# EAGLE design Wellation_A0 (EAGLE 7.6.0)
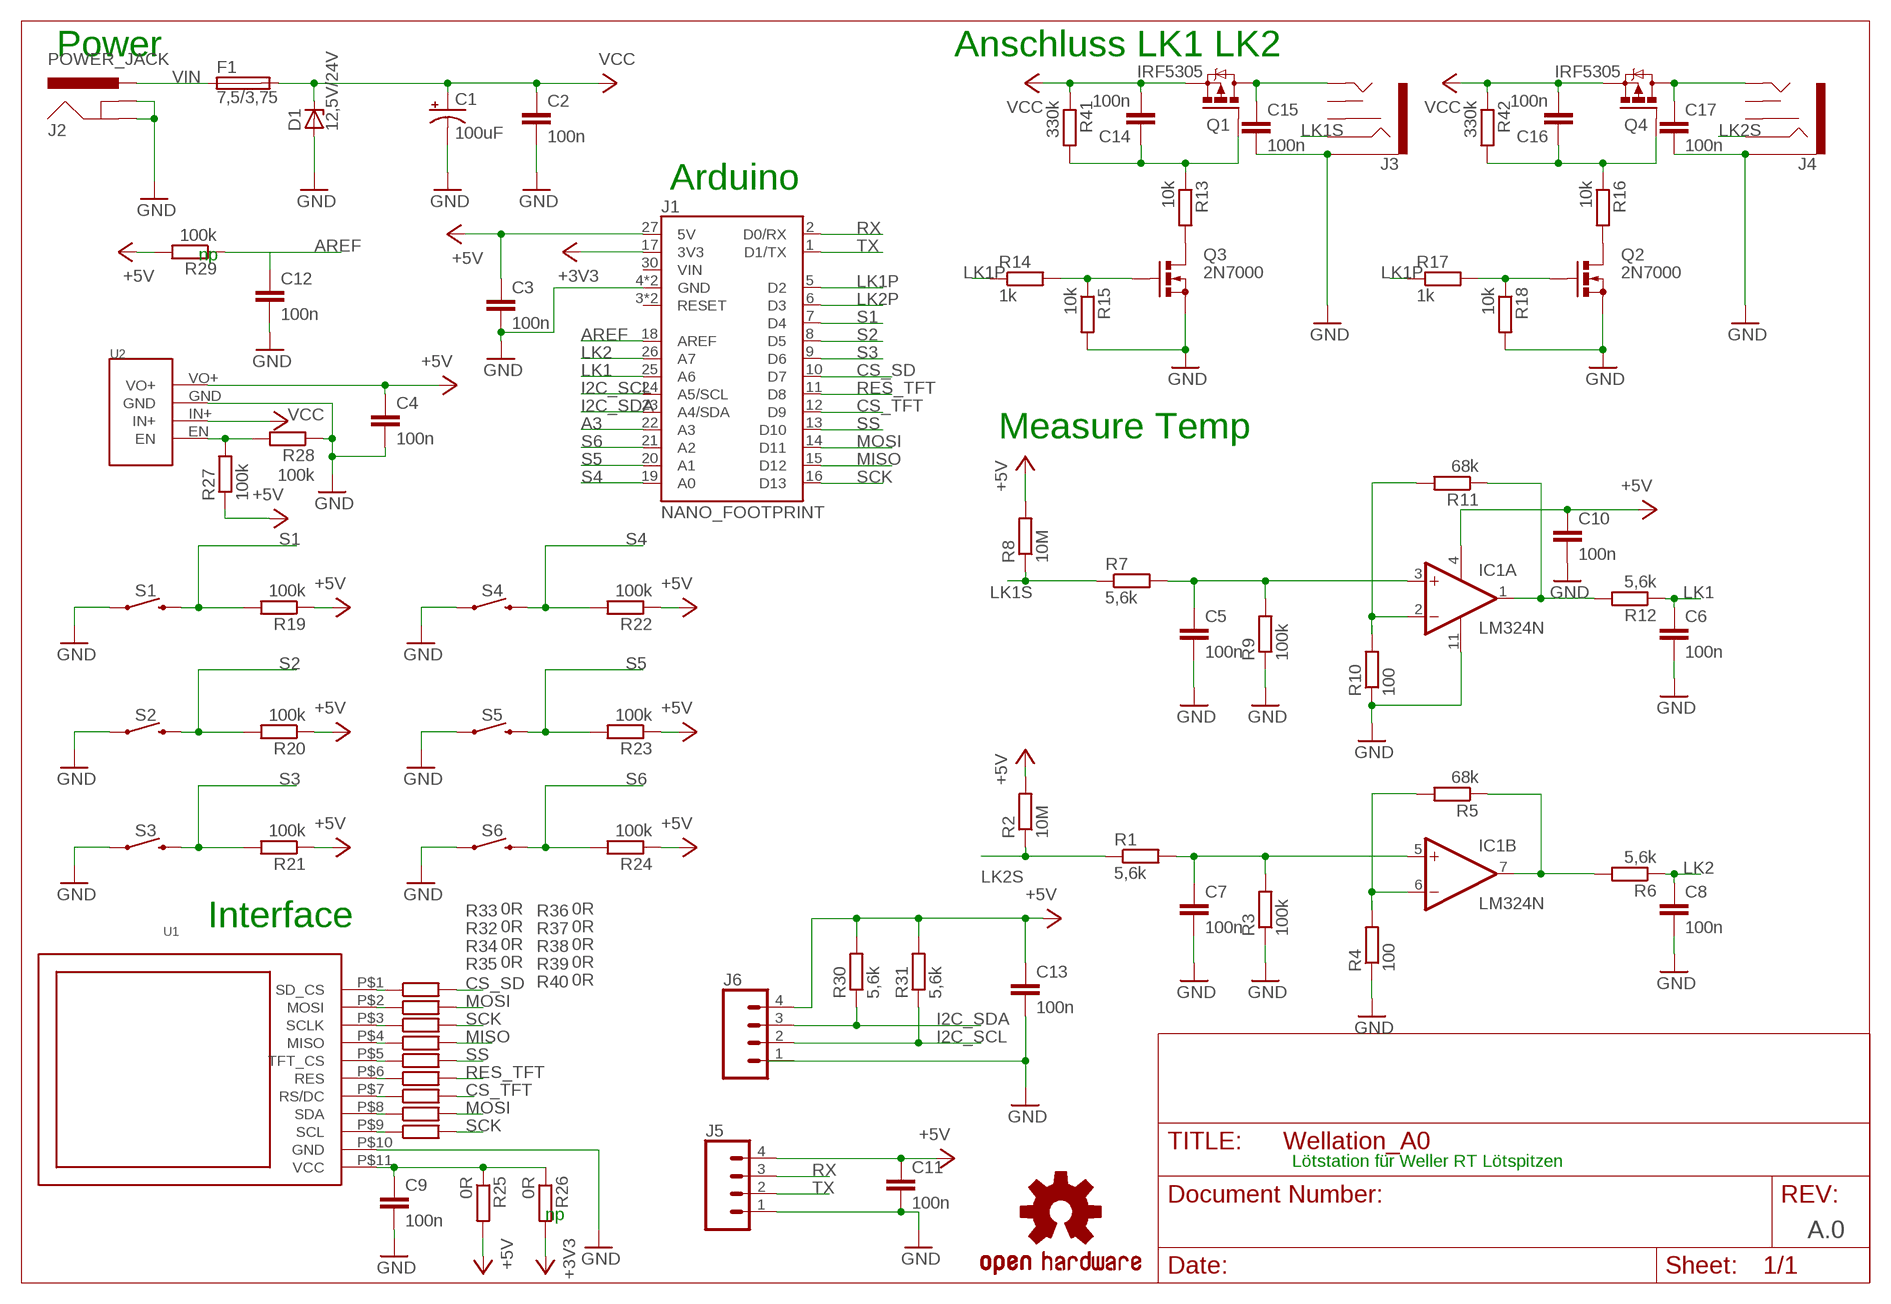
[diagram p0: schematic, sheet 1]

## Parts
C1  100uF  100UF-POLAR-RADIAL-2.5MM-25V-20%  [CPOL-RADIAL-2.5MM-6.5MM]
C2  100n  C-EUC0603K  [C0603K]
C3  100n  C-EUC0603K  [C0603K]
C4  100n  C-EUC0603K  [C0603K]
C5  100n  C-EUC0603K  [C0603K]
C6  100n  C-EUC0603K  [C0603K]
C7  100n  C-EUC0603K  [C0603K]
C8  100n  C-EUC0603K  [C0603K]
C9  100n  C-EUC0603K  [C0603K]
C10  100n  C-EUC0603K  [C0603K]
C11  100n  C-EUC0603K  [C0603K]
C12  100n  C-EUC0603K  [C0603K]
C13  100n  C-EUC0603K  [C0603K]
C14  100n  C-EUC0603K  [C0603K]
C15  100n  C-EUC0603K  [C0603K]
C16  100n  C-EUC0603K  [C0603K]
C17  100n  C-EUC0603K  [C0603K]
D1  12,5V/24V  ZENER-DIODEZD-12.5  [ZDIO12.5]
F1  7,5/3,75  GSH15  [GSH15]
IC1  LM324N  [DIL14]
J1  NANO_FOOTPRINT  [NANO]
J2  POWER_JACK  [POWER_JACK_PTH]
J3  AUDIO_JACK_3.5MM_PTH  [AUDIO-JACK]
J4  AUDIO_JACK_3.5MM_PTH  [AUDIO-JACK]
J5  CONN_04JST-PTH-VERT  [JST-4-PTH-VERT]
J6  CONN_04JST-PTH-VERT  [JST-4-PTH-VERT]
LOGO1  OSHW-LOGOM-COPPER  [OSHW-LOGO-M_COPPER]
Q1  IRF5305  IRF9530  [TO220BV]
Q2  2N7000  BS170  [SOT54E]
Q3  2N7000  BS170  [SOT54E]
Q4  IRF5305  IRF9530  [TO220BV]
R1  5,6k  R-EU_R0603  [R0603]
R2  10M  R-EU_R0603  [R0603]
R3  100k  R-EU_R0603  [R0603]
R4  100  R-EU_R0603  [R0603]
R5  68k  R-EU_R0603  [R0603]
R6  5,6k  R-EU_R0603  [R0603]
R7  5,6k  R-EU_R0603  [R0603]
R8  10M  R-EU_R0603  [R0603]
R9  100k  R-EU_R0603  [R0603]
R10  100  R-EU_R0603  [R0603]
R11  68k  R-EU_R0603  [R0603]
R12  5,6k  R-EU_R0603  [R0603]
R13  10k  R-EU_R0603  [R0603]
R14  1k  R-EU_R0603  [R0603]
R15  10k  R-EU_R0603  [R0603]
R16  10k  R-EU_R0603  [R0603]
R17  1k  R-EU_R0603  [R0603]
R18  10k  R-EU_R0603  [R0603]
R19  100k  R-EU_R0603  [R0603]
R20  100k  R-EU_R0603  [R0603]
R21  100k  R-EU_R0603  [R0603]
R22  100k  R-EU_R0603  [R0603]
R23  100k  R-EU_R0603  [R0603]
R24  100k  R-EU_R0603  [R0603]
R25  0R  R-EU_R0603  [R0603]
R26  0R  R-EU_R0603  [R0603]
R27  100k  R-EU_R0603  [R0603]
R28  100k  R-EU_R0603  [R0603]
R29  100k  R-EU_R0603  [R0603]
R30  5,6k  R-EU_R0603  [R0603]
R31  5,6k  R-EU_R0603  [R0603]
R32  0R  R-EU_R0603  [R0603]
R33  0R  R-EU_R0603  [R0603]
R34  0R  R-EU_R0603  [R0603]
R35  0R  R-EU_R0603  [R0603]
R36  0R  R-EU_R0603  [R0603]
R37  0R  R-EU_R0603  [R0603]
R38  0R  R-EU_R0603  [R0603]
R39  0R  R-EU_R0603  [R0603]
R40  0R  R-EU_R0603  [R0603]
R41  330k  R-EU_R0603  [R0603]
R42  330k  R-EU_R0603  [R0603]
S1  MOMENTARY-SWITCH-SPST-PTH-6.0MM  [TACTILE_SWITCH_PTH_6.0MM]
S2  MOMENTARY-SWITCH-SPST-PTH-6.0MM  [TACTILE_SWITCH_PTH_6.0MM]
S3  MOMENTARY-SWITCH-SPST-PTH-6.0MM  [TACTILE_SWITCH_PTH_6.0MM]
S4  MOMENTARY-SWITCH-SPST-PTH-6.0MM  [TACTILE_SWITCH_PTH_6.0MM]
S5  MOMENTARY-SWITCH-SPST-PTH-6.0MM  [TACTILE_SWITCH_PTH_6.0MM]
S6  MOMENTARY-SWITCH-SPST-PTH-6.0MM  [TACTILE_SWITCH_PTH_6.0MM]
U1  TFT1800WITHSD  [TFT1800WITHSD]
U2  MP2315  [MP2315_MODUL]

## Nets
+3V3: J1.17(3V3) R26.2
+5V: C3.1 C4.1 C10.1 C11.1 C13.1 IC1.4(P:V+) J1.27(5V) J5.4 J6.4 R2.2 R8.2 R19.1 R20.1 R21.1 R22.1 R23.1 R24.1 R25.2 R27.1 R29.2 R30.2 R31.2 U2.VO+
A3: J1.22(A3)
AREF: C12.1 J1.18(AREF) R29.1
CS_SD: J1.10(D7) R33.2
CS_TFT: J1.12(D9) R38.2
EN: R27.2 R28.2 U2.EN
GND: C1.2(-) C2.2 C3.2 C4.2 C5.2 C6.2 C7.2 C8.2 C9.2 C10.2 C11.2 C12.2 C13.2 C15.2 C17.2 D1.A IC1.11(P:V-) J1.4(GND) J1.29(GND) J2.GND J2.GNDBREAK J3.SLEEVE J4.SLEEVE J5.1 J6.1 Q2.S Q3.S R3.1 R4.1 R9.1 R10.1 R15.2 R18.2 R28.1 S1.1 S2.1 S3.1 S4.1 S5.1 S6.1 U1.P$10(GND) U2.GND
I2C_SCL: J1.24(A5/SCL) J6.2 R31.1
I2C_SDA: J1.23(A4/SDA) J6.3 R30.1
LK1: C6.1 J1.25(A6) R12.1
LK1P: J1.5(D2) R14.1 R17.1
LK1PP: C15.1 J3.TIP Q1.D
LK1PP1: C17.1 J4.TIP Q4.D
LK1S: J3.RING R7.1 R8.1
LK1SS: C5.1 IC1.3(A:+IN) R7.2 R9.2
LK2: C8.1 J1.26(A7) R6.1
LK2P: J1.6(D3)
LK2S: J4.RING R1.1 R2.1
LK2SS: C7.1 IC1.5(B:+IN) R1.2 R3.2
MF1: C14.1 Q1.G R13.1 R41.2
MF2: Q3.G R14.2 R15.1
MF3: C16.1 Q4.G R16.1 R42.2
MF4: Q2.G R17.2 R18.1
MISO: J1.15(D12) R35.2
MOSI: J1.14(D11) R32.2 R39.2
MP1S: Q3.D R13.2
MP2S: Q2.D R16.2
N$1: IC1.6(B:-IN) R4.2 R5.2
N$3: IC1.2(A:-IN) R10.2 R11.2
N$6: C9.1 R25.1 R26.1 U1.P$11(VCC)
OP1: IC1.1(A:OUT) R11.1 R12.2
OP2: IC1.7(B:OUT) R5.1 R6.2
RES_TFT: J1.11(D8) R37.2
RX: J1.2(D0/RX) J5.3
S1: J1.7(D4) R19.2 S1.3
S2: J1.8(D5) R20.2 S2.3
S3: J1.9(D6) R21.2 S3.3
S4: J1.19(A0) R22.2 S4.3
S5: J1.20(A1) R23.2 S5.3
S6: J1.21(A2) R24.2 S6.3
SCK: J1.16(D13) R34.2 R40.2
SD_CS: R33.1 U1.P$1(SD_CS)
SD_MISO: R35.1 U1.P$4(MISO)
SD_MOSI: R32.1 U1.P$2(MOSI)
SD_SCK: R34.1 U1.P$3(SCLK)
SS: J1.13(D10) R36.2
TFT_CS: R38.1 U1.P$7(RS/DC)
TFT_MOSI: R39.1 U1.P$8(SDA)
TFT_RES: R37.1 U1.P$6(RES)
TFT_SCK: R40.1 U1.P$9(SCL)
TFT_SS: R36.1 U1.P$5(TFT_CS)
TX: J1.1(D1/TX) J5.2
VCC: C1.1(+) C2.1 C14.2 C16.2 D1.C F1.2 Q1.S Q4.S R41.1 R42.1 U2.IN+
VIN: F1.1 J2.PWR
Unconnected: IC1.8(C:OUT) IC1.9(C:-IN) IC1.10(C:+IN) IC1.12(D:+IN) IC1.13(D:-IN) IC1.14(D:OUT) J1.3(RESET) J1.28(RESET) J1.30(VIN) J3.RSH J3.TSH J4.RSH J4.TSH

## Notes on the sheet
- Power | Anschluss LK1 LK2
- Arduino
- np
- Measure Temp
- Interface
- Lötstation für Weller RT Lötspitzen
- np
- A.0

## Library data of the parts
C1 = SparkFun-Capacitors:100UF-POLAR: 100µF polarized capacitors A capacitor is a passive two-terminal electrical component used to store electrical energy temporarily in an electric field.; PROD_ID: CAP-08439
C2-C17 = rcl:C-EU: CAPACITOR, European symbol
D1 = diode:ZENER-DIODE: Z-Diode
F1 = fuse:GSH15: FUSE HOLDER grid 15mm, 19649 Wickmann; MPN: 64900001039; OC_FARNELL: 1271673; OC_NEWARK: 02P0318
IC1 = linear:LM324: OP AMP
J1 = SparkFun-Boards:NANO_FOOTPRINT: Generic Nano Footprint
J2 = SparkFun-Connectors:POWER_JACK: Power Jack Connector This is the standard 5.5mm barrel jack for power. The PTH is the most common, proven, reliable, footprint. The Slot footprint only works if the mill layer is transmitted to the PCB fab house so be warned. Here are the connectors we sell at SparkFun: DC Barrel Power Jack/Connector <https://www.sparkfun.com/products/119> (PRT-00119) DC Barrel Power Jack/Connector (SMD) <https://www.sparkfun.com/products/12748> (PRT-12748) DC Barrel Jack Adapter - Breadboard Compatible <https://www.sparkfun.com/products/10811> (PRT-10811) It is used on this SparkFun product (and many, many others): SparkFun RedBoard - Programmed with Arduino <https://www.sparkfun.com/products/12757> (DEV-12757) Also, if you need a mating power supply or connector, please check these out: Wall Adapter Power Supply - 9VDC 650mA <https://www.sparkfun.com/products/298> (TOL-00298) DC Barrel Jack Adapter - Male <https://www.sparkfun.com/products/10287> (PRT-10287); PROD_ID: CONN-08197
J3 J4 = SparkFun-Connectors:AUDIO_JACK_3.5MM: Audio Jack 3.5mm variants of PTH and SMT stereo audio jack with bypass switches. SparkFun Products: SparkFun SparkPunk Sound Kit <[https://www.sparkfun.com/products/11177]> - PTH MP3 Trigger <https://www.sparkfun.com/products/13720> -3.5mm SMD SparkFun PicoBoard <https://www.sparkfun.com/products/11888>- 2.5mm SMD; PROD_ID: CONN-08774; SF_ID: PRT-08032
J5 J6 = SparkFun-Connectors:CONN_04: Multi connection point. Often used as Generic Header-pin footprint for 0.1 inch spaced/style header connections On any of the 0.1 inch spaced packages, you can populate with these: Break Away Headers - Straight <https://www.sparkfun.com/products/116> (PRT-00116) Break Away Male Headers - Right Angle <https://www.sparkfun.com/products/553> (PRT-00553) Female Headers <https://www.sparkfun.com/products/115> (PRT-00115) Break Away Headers - Machine Pin <https://www.sparkfun.com/products/117> (PRT-00117) Break Away Female Headers - Swiss Machine Pin <https://www.sparkfun.com/products/743> (PRT-00743) For SCREWTERMINALS and SPRING TERMINALS visit here: Screw Terimnals on SparkFun.com <https://www.sparkfun.com/search/results?term=Screw+Terminals> (5mm/3.5mm/2.54mm spacing) This device is also useful as a general connection point to wire up your design to another part of your project. Our various solder wires solder well into these plated through hole pads. Hook-Up Wire - Assortment (Stranded, 22 AWG) <https://www.sparkfun.com/products/11375> (PRT-11375) Hook-Up Wire - Assortment (Solid Core, 22 AWG) <https://www.sparkfun.com/products/11367> (PRT-11367) View the entire wire category on our website here <https://www.sparkfun.com/categories/141> Special notes: Molex polarized connector foot print use with SKU : PRT-08231 with associated crimp pins and housings. 1MM SMD Version SKU: PRT-10208; PROD_ID: CONN-13251
LOGO1 = SparkFun-Aesthetics:OSHW-LOGO: Open-Source Hardware (OSHW) Logo This logo indicates the piece of hardware it is found on incorporates a OSHW license and/or adheres to the definition of open source hardware found here: http://freedomdefined.org/OSHW
Q1 Q4 = transistor-power:IRF9530: P-CHANNEL HEXFET POWER-MOS-FET Source: http://www.irf.com/product-info/datasheets/data/irf9530.pdf
Q2 Q3 = transistor-small-signal:BS170: N-CHANNEL MOS FET
R1-R42 = rcl:R-EU_: RESISTOR, European symbol
S1-S6 = SparkFun-Switches:MOMENTARY-SWITCH-SPST: Momentary Switch (Pushbutton) - SPST Normally-open (NO) SPST momentary switches (buttons, pushbuttons). Variants PTH-12MM - 12mm square, through-hole Momentary Pushbutton Switch - 12mm Square <https://www.sparkfun.com/products/9190> (COM-09190) PTH-6.0MM, PTH-6.0MM-KIT - 6.0mm square, through-hole Mini Pushbutton Switch <https://www.sparkfun.com/products/97> (COM-00097) KIT package intended for soldering kit's - only one side of pads' copper is exposed. PTH-RIGHT-ANGLE-KIT - Right-angle, through-hole Right Angle Tactile Button <https://www.sparkfun.com/products/10791> - Used on SparkFun BigTime Watch Kit <https://www.sparkfun.com/products/11734> SMD-12MM - 12mm square, surface-mount Tactile Button - SMD (12mm) <https://www.sparkfun.com/products/12993> (COM-12993) Used on SparkFun PicoBoard <https://www.sparkfun.com/products/11888> SMD-4.5MM - 4.5mm Square Trackball Switch Used on SparkFun Blackberry Trackballer Breakout <https://www.sparkfun.com/products/13169> SMD-4.6MMX2.8MM - 4.60mm x 2.80mm, surface mount Used on SparkFun SAMD21 Mini Breakout <https://www.sparkfun.com/products/13664> SMD-5.2MM, SMD-5.2-REDUNDANT - 5.2mm square, surface-mount Mini Pushbutton Switch - SMD <https://www.sparkfun.com/products/8720> (COM-08720) Used on Arduino Pro Mini <https://www.sparkfun.com/products/11114> REDUNDANT package connects both switch circuits together SMD-6.0X3.5MM - 6.0 x 3.5mm, surface mount Momentary Reset Switch SMD <https://www.sparkfun.com/products/8229> (COM-08229) SMD-6.2MM-TALL - 6.2mm square, surface mount Tactile Button - SMD (6mm) <https://www.sparkfun.com/products/12992> Used on SparkFun Digital Sandbox <https://www.sparkfun.com/products/12651> SMD-RIGHT-ANGLE - Right-angle, surface mount Used on SparkFun Block for Intel® Edison - Arduino <https://www.sparkfun.com/products/13036>; PROD_ID: SWCH-08441; SF_SKU: COM-00097
U1 = inode:TFT1800WITHSD: Adafruit TFT 1.8" with SD (ST7735) 1.8" 18-bit color TFT LCD display with microSD card breakout http://www.adafruit.com/products/358
U2 = specialparts:MP2315

## Board
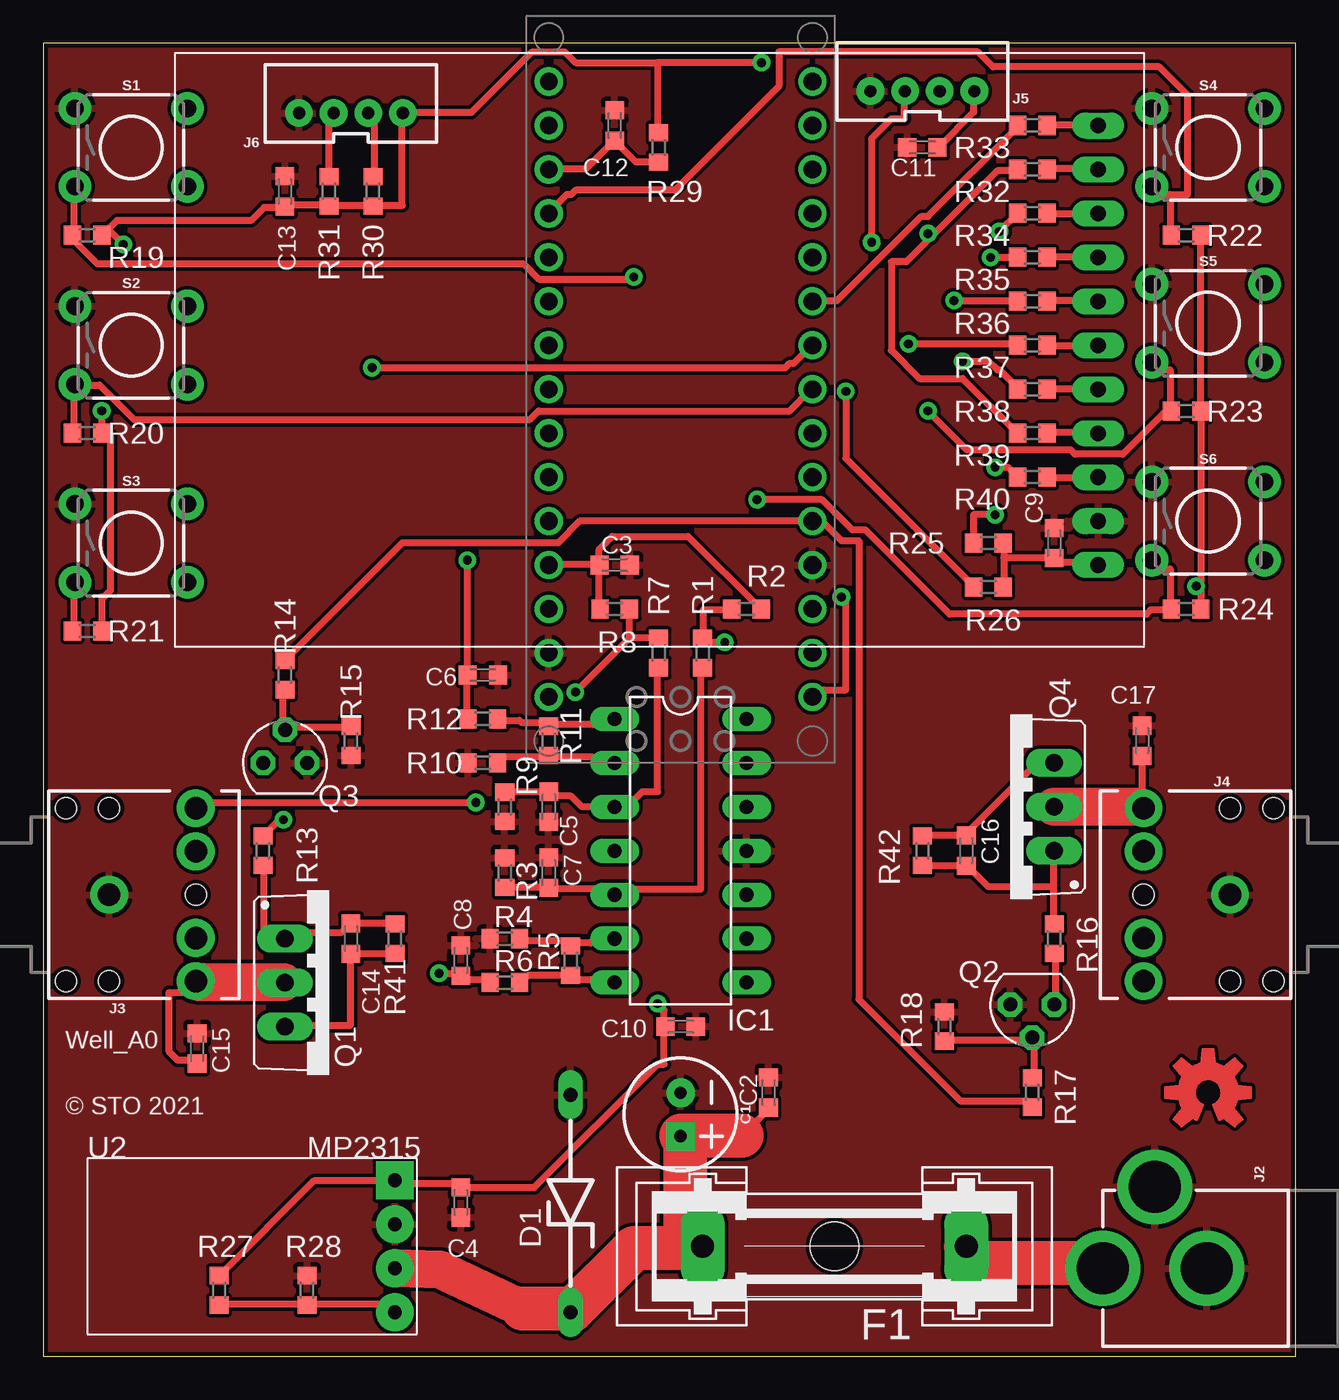
[diagram p1: board, top side]
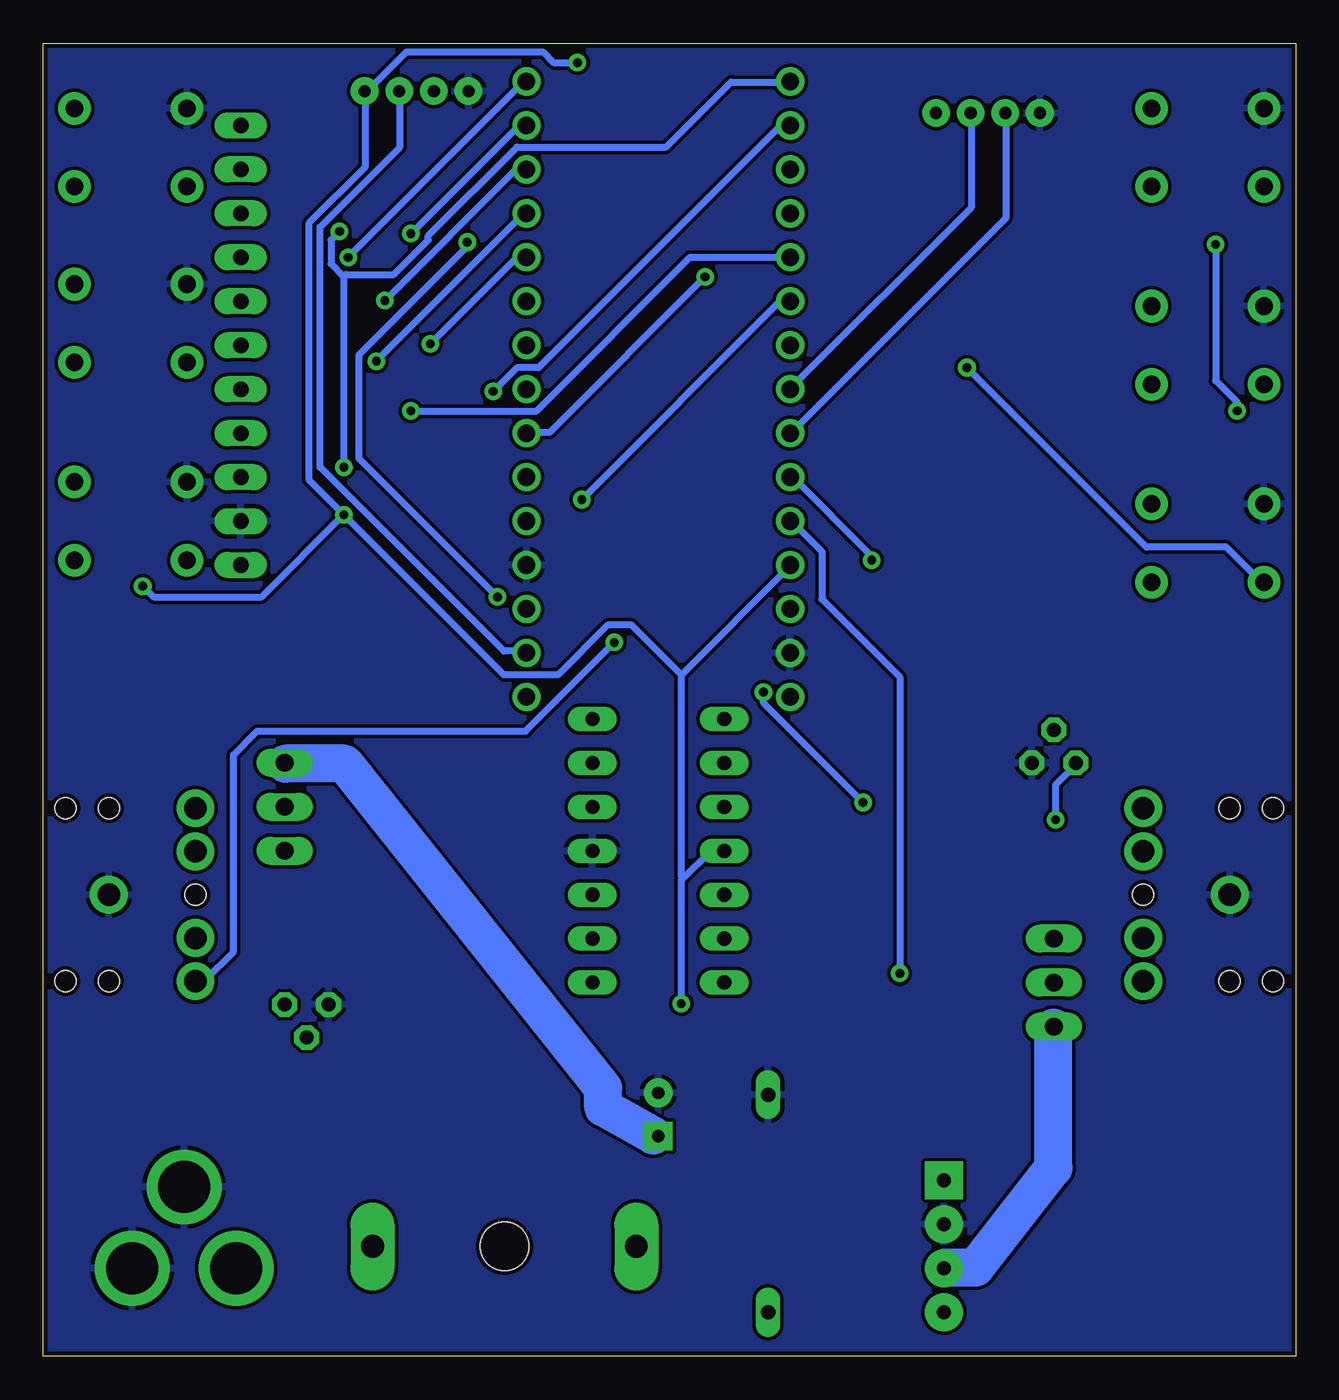
[diagram p2: board, bottom side, seen from below]

Size 72.37 x 75.87 mm. Coordinates in mm from the lower left corner, seen from the top.
Outline: 0,0 72.37,0 72.37,75.87 0,75.87 0,0
Copper layers (1*16): Top 0.035mm / dielectric 1.5mm / Bottom 0.035mm
Design rules "SparkFun *": minimum track width 16mil, minimum drill 20mil, track to track 8mil, track to pad 8mil, pad to pad 8mil, via to via 8mil, smd to smd 8mil, copper to edge 10mil, drill to drill 8mil, minimum pad ring 12mil, minimum via ring 10mil, stop-mask expansion 4mil, vias tented up to drill 25mil, thermal gap 10mil

### Footprints (pad centres in the part's own frame; a part is rotated, then mirrored left to right if it is on the bottom)
CPOL-RADIAL-2.5MM-6.5MM = drill 0.7 pad 1.651 square: 1 1.25,0 | drill 0.7 pad 1.651: 2 -1.25,0
C0603K = smd 1.05 x 1.08: 1 -0.875,0; 2 0.875,0
ZDIO12.5 = drill 0.813 long: A 6.223,0; C -6.35,0
GSH15 = drill 1.321 pad 2.54 long: 1 -7.62,0; 2 7.62,0 | hole 2.794: 0,0
DIL14 = drill 0.813 long: 1 -7.62,-3.81; 2 -5.08,-3.81; 3 -2.54,-3.81; 4 0,-3.81; 5 2.54,-3.81; 6 5.08,-3.81; 7 7.62,-3.81; 8 7.62,3.81; 9 5.08,3.81; 10 2.54,3.81; 11 0,3.81; 12 -2.54,3.81; 13 -5.08,3.81; 14 -7.62,3.81
NANO = drill 1.016: 1 -7.62,17.78; 2 -7.62,15.24; 3 -7.62,12.7; 4 -7.62,10.16; 5 -7.62,7.62; 6 -7.62,5.08; 7 -7.62,2.54; 8 -7.62,0; 9 -7.62,-2.54; 10 -7.62,-5.08; 11 -7.62,-7.62; 12 -7.62,-10.16; 13 -7.62,-12.7; 14 -7.62,-15.24; 15 -7.62,-17.78; 16 7.62,-17.78; 17 7.62,-15.24; 18 7.62,-12.7; 19 7.62,-10.16; 20 7.62,-7.62; 21 7.62,-5.08; 22 7.62,-2.54; 23 7.62,0; 24 7.62,2.54; 25 7.62,5.08; 26 7.62,7.62; 27 7.62,10.16; 28 7.62,12.7; 29 7.62,15.24; 30 7.62,17.78
POWER_JACK_PTH = drill 2.997 pad 4.318: GND 0,7.7; GNDBREAK 4.7,10.7; PWR 0,13.7
AUDIO-JACK = drill 1.3 pad 2.184: RING 5,5; RSH 5,2.5; SLEEVE 0,0; TIP 5,-5; TSH 5,-2.5 | hole 1.2: 0,5; -2.5,5; -2.5,-5; 0,-5; 5,0
JST-4-PTH-VERT = drill 0.7 pad 1.6: 1 -3,-0.55; 2 -1,-0.55; 3 1,-0.55; 4 3,-0.55
TO220BV = drill 1.016 long: D 0,-2.54; G -2.54,-2.54; S 2.54,-2.54
SOT54E = drill 0.813 octagon: D -1.27,0; G 0,1.905; S 1.27,0
R0603 = smd 1 x 1.1: 1 -0.85,0; 2 0.85,0
TACTILE_SWITCH_PTH_6.0MM = drill 1.016 pad 1.88: 1 -3.251,2.261; 2 3.251,2.261; 3 -3.251,-2.261; 4 3.251,-2.261
TFT1800WITHSD = drill 0.9 long: P$1 24.13,12.7; P$2 24.13,10.16; P$3 24.13,7.62; P$4 24.13,5.08; P$5 24.13,2.54; P$6 24.13,0; P$7 24.13,-2.54; P$8 24.13,-5.08; P$9 24.13,-7.62; P$10 24.13,-10.16; P$11 24.13,-12.7
MP2315_MODUL = drill 0.8 pad 2.184: EN 17.78,1.27; GND 17.78,6.35; IN+ 17.78,3.81 | drill 0.8 pad 2.184 square: VO+ 17.78,8.89

### Placement (x,y rotation side)
C1  36.83,13.97 270 top
C2  41.91,15.24 90 top
C3  33.02,45.72 0 top
C4  24.13,8.89 270 top
C5  29.21,31.75 270 top
C6  25.4,39.37 0 top
C7  29.21,27.94 90 top
C8  24.13,22.86 90 top
C9  58.42,46.99 90 top
C10  36.83,19.05 0 top
C11  50.8,69.85 180 top
C12  33.02,71.12 90 top
C13  13.97,67.31 90 top
C14  17.78,24.13 270 top
C15  8.89,17.78 90 top
C16  53.34,29.21 90 top
C17  63.5,35.56 90 top
D1  30.48,8.89 90 top
F1  45.72,6.35 180 top
IC1  36.83,29.21 270 top
J1  36.83,55.88 180 top
J2  74.93,5.08 90 top
J3  3.81,26.67 0 top
J4  68.58,26.67 180 top
J5  50.8,73.66 0 top
J6  17.78,72.39 0 top
LOGO1  67.31,15.24 0 top
Q1  16.51,21.59 270 top
Q2  57.15,20.32 180 top
Q3  13.97,34.29 0 top
Q4  55.88,31.75 90 top
R1  38.1,40.64 270 top
R2  40.64,43.18 0 top
R3  26.67,27.94 270 top
R4  26.67,24.13 0 top
R5  30.48,22.86 90 top
R6  26.67,21.59 0 top
R7  35.56,40.64 270 top
R8  33.02,43.18 180 top
R9  26.67,31.75 90 top
R10  25.4,34.29 0 top
R11  29.21,35.56 270 top
R12  25.4,36.83 0 top
R13  12.7,29.21 90 top
R14  13.97,39.37 270 top
R15  17.78,35.56 270 top
R16  58.42,24.13 270 top
R17  57.15,15.24 90 top
R18  52.07,19.05 90 top
R19  2.54,64.77 180 top
R20  2.54,53.34 180 top
R21  2.54,41.91 180 top
R22  66.04,64.77 180 top
R23  66.04,54.61 180 top
R24  66.04,43.18 180 top
R25  54.61,46.99 180 top
R26  54.61,44.45 180 top
R27  10.16,3.81 270 top
R28  15.24,3.81 270 top
R29  35.56,69.85 90 top
R30  19.05,67.31 270 top
R31  16.51,67.31 270 top
R32  57.15,68.58 180 top
R33  57.15,71.12 180 top
R34  57.15,66.04 180 top
R35  57.15,63.5 180 top
R36  57.15,60.96 180 top
R37  57.15,58.42 180 top
R38  57.15,55.88 180 top
R39  57.15,53.34 180 top
R40  57.15,50.8 180 top
R41  20.32,24.13 90 top
R42  50.8,29.21 270 top
S1  5.08,69.85 0 top
S2  5.08,58.42 0 top
S3  5.08,46.99 0 top
S4  67.31,69.85 0 top
S5  67.31,59.69 0 top
S6  67.31,48.26 0 top
U1  36.83,58.42 0 top
U2  2.54,1.27 0 top

### Tracks (layer width: path | path; a pad name or v marks a point on that pad's centre or on a via)
+3V3  (via drill 0.51)
  Top 0.406: v46.38,55.75 46.38,51.88 53.75,44.5 R26.2
  Bottom 0.406: v46.38,55.75 45,57.12 43.75,57.12 29.88,71 29.25,71 J1.17
+5V  (via drill 0.51)
  Top 0.406: 35.5,74.75 35.5,70.75 R29.2 | 35.5,74.75 30.75,74.75 30.12,75.38 28.25,75.38 24.75,71.88 20.88,71.88 J6.4 20.75,71.75 20.75,66.5 19.25,66.5 R30.2 19,66.5 16.62,66.5 R31.2 16.5,66.5 14,66.5 C13.1 13.88,66.38 12.75,66.38 12,65.62 4.25,65.62 3.5,64.88 R19.1 3.88,65 v4.62,64.25 | R21.1 3.38,42 3.38,43.88 3.5,43.88 3.88,44.25 3.88,53.25 3.5,53.25 R20.1 3.38,53.5 v3.38,54.62 | C11.1 51.75,69.88 53.75,71.88 53.75,73 J5.4 | 66.88,44.5 66.88,54.5 R23.1 66.88,54.75 66.88,64.75 R22.1 | 66.88,44.5 66.88,43.25 R24.1 | v55,48.62 53.75,48.62 R25.2 | v66.62,44.5 66.88,44.5 | C3.1 32.12,45.62 32.12,43.25 R8.2 | R2.2 41.38,43.25 37.25,47.38 32.88,47.38 32.12,46.62 32.12,45.88 C3.1 | J1.27 29.25,45.75 32,45.75 C3.1 | R27.1 15.62,10.12 20.12,10.12 U2.VO+ 20.38,10.12 20.5,10 24,10 24.12,9.88 C4.1 24.25,9.75 28.38,9.75 35.5,16.88 35.88,16.88 35.88,19 C10.1 35.88,19.12 35.88,20 v35.5,20.38 | v41.5,74.75 35.5,74.75
  Bottom 0.406: v3.38,54.62 3.38,55.12 4.62,56.38 v4.62,64.25 | v55,48.62 59.75,43.88 66,43.88 v66.62,44.5 | v55,48.62 57,50.62 57,65.5 53.75,68.75 53.75,73 J5.4 53.62,73.12 51.38,75.38 43.5,75.38 42.88,74.75 v41.5,74.75 | 35.38,27.62 35.5,27.5 v35.5,20.38 | 35.38,27.62 33.88,29.12 33.12,29.12 IC1.4 | 35.5,39.38 29.25,45.62 J1.27 | 35.5,39.38 35.5,27.75 35.38,27.62 | v55,48.62 45.75,39.38 42.62,39.38 39.75,42.25 38.38,42.25 35.5,39.38
AREF
  Top 0.406: R29.1 34.25,69 33.12,70.12 C12.1 32.88,70.12 31.38,68.62 29.25,68.62 J1.18
CS_SD
  Top 0.406: R33.2 56.25,71 51.12,65.88 50.75,65.88 45.88,61 44.5,61 J1.10
CS_TFT  (via drill 0.51)
  Top 0.406: v53.12,57.5 54.62,57.5 55.12,57 55.25,57 56.25,56 R38.2
  Bottom 0.406: v53.12,57.5 44.5,66.12 J1.12
EN
  Top 0.406: R27.2 10.25,3 15.12,3 R28.2 15.38,3 19.38,3 19.75,2.62 20.25,2.62 U2.EN
GND
  pour Top: 0,0 72.39,0 72.39,76.2 0,76.2
  pour Bottom: 0,0 72.39,0 72.39,76.2 0,76.2
I2C_SCL
  Top 0.406: R31.1 16.5,68.25 16.5,71.75 16.75,71.75 J6.2
  Bottom 0.406: J1.24 29.12,53.38 16.75,65.75 16.75,71.75 J6.2
I2C_SDA
  Top 0.406: R30.1 19.12,68.25 19.12,71.75 18.88,71.75 J6.3
  Bottom 0.406: J1.23 29.12,56 18.75,66.38 18.75,71.75 J6.3
LK1  (via drill 0.51)
  Top 0.406: R12.1 24.5,36.88 24.5,39.25 C6.1 24.5,39.5 v24.5,46
  Bottom 0.406: v24.5,46 24.5,46.25 29.12,50.88 J1.25
LK1P
  Top 0.406: R14.1 20.75,47 29.75,47 31,48.25 44.38,48.25 J1.5 44.62,48.25 45,48.25 46.12,47.12 47.12,47.12 47.12,20.62 53,14.75 56.88,14.75 57.12,14.5 R17.1
LK1PP
  Top 0.406: C15.1 8.88,17 8.75,17.12 7.75,17.12 7.25,17.62 7.25,21 8,21 8.62,21.62 8.75,21.62 J3.TIP 9,21.62 | 13.88,21.62 Q1.D
  Top 2.184: 9,21.62 13.88,21.62
LK1PP1
  Top 0.406: C17.1 63.5,31.75 J4.TIP 63.38,31.75
  Top 2.184: 63.38,31.75 Q4.D
LK1S  (via drill 0.51)
  Top 0.406: 33.88,41.5 33.88,43.12 R8.1 | 33.88,41.5 35.5,41.5 R7.1 | v30.75,38.38 33.88,41.5 | v25,32 9.12,32 8.88,31.75 J3.RING
  Bottom 0.406: v30.75,38.38 30.75,37.75 v25,32
LK1SS
  Top 0.406: R9.2 26.75,32.62 C5.1 29.38,32.62 29.62,32.38 30.5,32.38 31.12,31.75 IC1.3 33.75,31.75 34.62,32.62 35.5,32.62 35.5,39.75 R7.2
LK2  (via drill 0.51)
  Top 0.406: R6.1 25.75,21.62 25.62,21.75 24.38,21.75 24.25,21.88 C8.1 24,22.12 v22.88,22.12
  Bottom 0.406: v22.88,22.12 22.88,39.25 27.38,43.75 27.38,46.5 29.12,48.25 J1.26
LK2S  (via drill 0.51)
  Top 0.406: R2.1 39.75,43.12 38.12,43.12 38.12,41.5 R1.1 38.25,41.38 38.38,41.25 v39.38,41.25
  Bottom 0.406: v39.38,41.25 44.5,36.12 60,36.12 61.38,34.75 61.38,23.38 63,21.75 63.5,21.75 J4.RING
LK2SS
  Top 0.406: R3.2 26.75,27.12 29.12,27.12 C7.1 29.38,27 34,27 IC1.5 33.12,26.75 34,26.75 34.25,27 38,27 38,39.75 R1.2
MF1
  Top 0.406: R41.2 20.25,25 17.88,25 C14.1 17.62,24.88 17.25,24.5 12.88,24.5 Q1.G 13.88,24.25 12.75,24.25 12.75,28.25 R13.1
MF2
  Top 0.406: R14.2 13.88,38.5 13.88,36.25 Q3.G 14,36.38 17.75,36.38 R15.1
MF3
  Top 0.406: R42.2 50.88,28.38 53.25,28.38 C16.1 53.5,28.25 54.62,27.12 58.38,27.12 | 58.38,27.12 58.38,29.12 Q4.G | 58.38,27.12 58.38,25 R16.1
MF4
  Top 0.406: R18.1 52.12,18.25 57,18.25 57.12,18.38 Q2.G 57.12,18.12 57.25,18.12 57.25,16.12 R17.2
MISO  (via drill 0.51)
  Top 0.406: v54.75,63.5 R35.2
  Bottom 0.406: v54.75,63.5 44.5,73.75 J1.15
MOSI  (via drill 0.51)
  Top 0.406: 51.38,64.75 55.12,68.5 56.25,68.5 R32.2 | 51.38,64.75 49.88,63.25 49,63.25 49,58.12 50.62,56.5 53.12,56.5 56.25,53.38 R39.2 | v51.12,64.88 51.25,64.88 51.38,64.75
  Bottom 0.406: v51.12,64.88 45,71 44.5,71 J1.14
MP1S  (via drill 0.51)
  Top 0.406: v13.88,31 13.62,31 12.75,30.12 R13.2
  Bottom 0.406: v13.88,31 13.88,33 12.62,34.25 Q3.D
MP2S
  Top 0.406: R16.2 58.5,23.25 58.5,20.38 Q2.D
N$1
  Top 0.406: IC1.6 33,24.12 31.88,24.12 31.62,23.88 30.62,23.88 30.5,23.75 R5.2 30.5,24 27.75,24 27.62,24.12 R4.2
N$3
  Top 0.406: R10.2 26.25,34.38 26.5,34.62 29.12,34.62 R11.2 29.38,34.62 31.75,34.62 32,34.38 33,34.38 IC1.2
N$6
  Top 0.406: 55.5,46.12 55.5,46.88 R25.1 | 55.5,46.12 55.5,44.5 R26.1 | U1.P$11 60.88,45.75 60.75,45.88 58.62,45.88 58.5,46 C9.1 58.25,46.12 55.5,46.12
OP1
  Top 0.406: R12.2 26.25,36.75 27.5,36.75 27.62,36.62 29,36.62 29.12,36.5 R11.1 29.38,36.5 31.75,36.5 32,36.75 33,36.75 IC1.1
OP2
  Top 0.406: R6.2 27.62,21.62 28,22 30.38,22 R5.1 30.62,21.88 30.75,21.75 32.88,21.75 33,21.62 IC1.7
RES_TFT  (via drill 0.51)
  Top 0.406: v50,58.5 56.25,58.5 R37.2
  Bottom 0.406: v50,58.5 45,63.5 J1.11
RX
  Bottom 0.406: J5.3 51.75,73 51.75,69.88 56.38,65.25 56.38,51.38 45.75,40.75 44.5,40.75 J1.2
S1  (via drill 0.51)
  Top 0.406: S1.3 1.75,67.5 1.75,64.88 R19.2 1.62,64.62 3.12,63.12 27.75,63.12 28.62,62.25 34,62.25 v34.12,62.38
  Bottom 0.406: v34.12,62.38 43.12,53.38 44.38,53.38 J1.7
S2
  Top 0.406: R20.2 1.75,53.38 1.75,56.12 S2.3 2,56.12 3.25,56.12 5.25,54.12 28.12,54.12 28.62,54.62 43.12,54.62 44.38,55.88 J1.8
S3  (via drill 0.51)
  Top 0.406: R21.2 1.75,42 1.75,44.62 S3.3 | v19,57.12 42.88,57.12 43.12,57.38 43.38,57.38 44.38,58.38 J1.9
  Bottom 0.406: v19,57.12 8.62,46.75 4,46.75 1.88,44.62 S3.3
S4
  Top 0.406: 65.12,67.12 65.12,64.88 R22.2 | 65.12,67.12 64.5,67.12 64.12,67.5 S4.3 | 65.12,67.12 66.12,67.12 66.12,72.88 64.5,74.5 54.88,74.5 54,75.38 42.5,75.38 42.5,73.38 36.5,67.38 30.75,67.38 30.5,67.12 30.25,67.12 29.25,66.12 J1.19
S5  (via drill 0.51)
  Top 0.406: S5.3 64.12,57.38 64.5,57 65.12,57 65.12,54.62 R23.2 65,54.5 64.75,54.5 62.38,52.12 59.62,52.12 59.38,52.38 53.38,52.38 v51.12,54.62
  Bottom 0.406: J1.20 35,63.5 43.88,54.62 v51.12,54.62
S6  (via drill 0.51)
  Top 0.406: S6.3 64.12,45.88 64.38,45.88 64.75,45.5 65.12,45.5 65.12,43.25 R24.2 65,43.12 64,43.12 63.75,42.88 52.38,42.88 47.5,47.75 46.75,47.75 45,49.5 v41.25,49.5
  Bottom 0.406: v41.25,49.5 29.88,60.88 29.25,60.88 J1.21
SCK  (via drill 0.51)
  Top 0.406: v55,51.38 55.75,51.38 56.25,50.88 R40.2 | v55.25,65 56.25,66 R34.2
  Bottom 0.406: 55,62.38 v55,51.38 | 55,62.38 55.75,63.12 55.75,64.5 v55.25,65 | J1.16 29.25,73.62 32.62,73.62 36.38,69.88 45,69.88 50.12,64.75 50.12,64.5 52.12,62.5 54.88,62.5 55,62.38
SD_CS
  Top 0.406: R33.1 60.88,71.12 U1.P$1
SD_MISO
  Top 0.406: U1.P$4 R35.1
SD_MOSI
  Top 0.406: R32.1 58,68.62 60.88,68.62 U1.P$2
SD_SCK
  Top 0.406: R34.1 58,66 60.88,66 U1.P$3
SS  (via drill 0.51)
  Top 0.406: v52.62,61 56.25,61 R36.2
  Bottom 0.406: v52.62,61 45.12,68.5 44.5,68.5 J1.13
TFT_CS
  Top 0.406: R38.1 60.88,55.88 U1.P$7
TFT_MOSI
  Top 0.406: R39.1 58,53.38 60.88,53.38 U1.P$8
TFT_RES
  Top 0.406: R37.1 58,58.38 60.88,58.38 U1.P$6
TFT_SCK
  Top 0.406: R40.1 58,50.75 60.88,50.75 U1.P$9
TFT_SS
  Top 0.406: R36.1 58,61 60.88,61 U1.P$5
TX  (via drill 0.51)
  Top 0.406: v47.88,64.38 47.88,70.38 49,71.5 49.75,71.5 49.75,73 J5.2 | v46.12,43.88 46.38,43.62 46.38,38.5 45.12,38.5 44.75,38.12 44.5,38.12 J1.1
  Bottom 0.406: v47.88,64.38 47.88,64.12 54.12,57.88 54.12,51.88 v46.12,43.88
VCC
  Top 0.406: R42.1 50.88,30.12 53.25,30.12 C16.2 53.38,30.25 57.38,34.25 58.38,34.25 Q4.S | R41.1 20.25,23.25 17.88,23.25 C14.2 17.75,23.12 17.75,19.12 14,19.12 Q1.S | 40.38,12.75 41.88,14.25 C2.1 | 36.88,12.75 C1.1 37.12,12.62 | 30.5,2.62 D1.C 30.38,2.75 | 38,6.25 F1.2 37.12,6.38
  Top 2.184: 27.7,2.75 22.91,5 U2.IN+
  Top 2.54: 36.88,12.75 40.38,12.75 | 30.5,2.62 34.12,6.25 38,6.25 | 30.38,2.75 27.7,2.75 | 37.12,6.38 37.12,12.62
  Bottom 0.406: 14,19 Q1.S | 20.25,5.12 U2.IN+ | 37.12,12.75 36.88,12.75 C1.1 | 58.38,34.25 Q4.S
  Bottom 2.184: 14,19 14,10.88 18.48,5.12 20.25,5.12 | 58.38,34.25 54.96,34.25 40.02,15.5 40.02,14.38 37.12,12.75
VIN
  Top 0.406: 54.25,5.38 53.38,6.25 | 61.12,5.12 60.88,5.38
  Top 2.54: 60.88,5.38 54.25,5.38 | 53.38,6.25 F1.1 | 61.12,5.12 J2.PWR

### Text on the board
tNames: Well_A0 | © STO 2021